# Altium schematic sheet Sheet_1.schdoc
size 257 x 178 mm
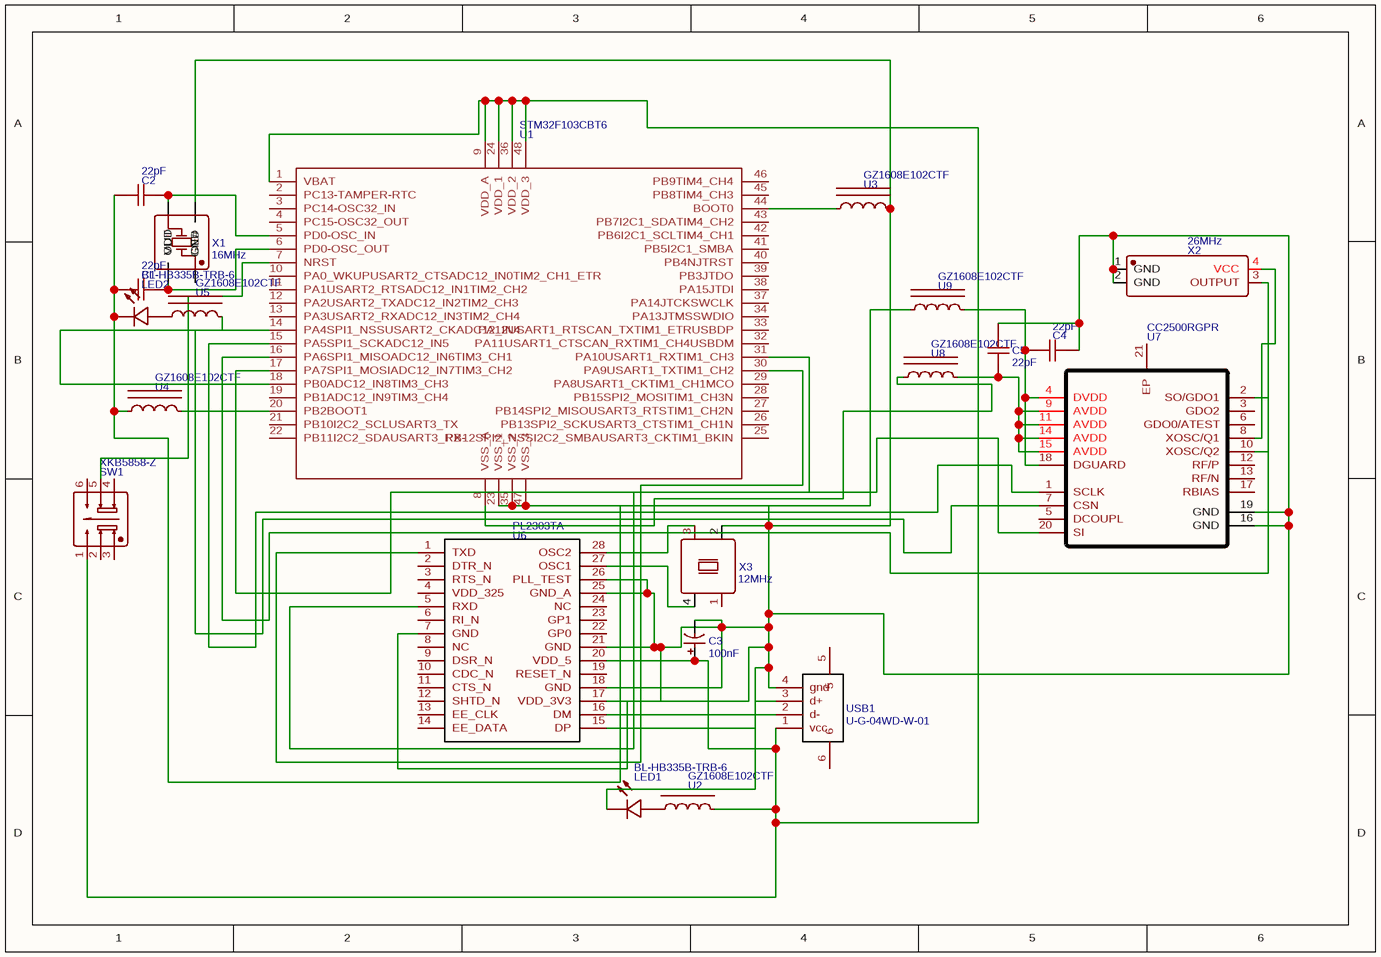
[diagram p0: Sheet_1.schdoc]

## Parts
C1  22pF  [CAP-TH_L4.8-W3.2-P5.08-D0.5]
C2  22pF  [CAP-TH_L4.8-W3.2-P5.08-D0.5]
C3  100nF  [CAP-TH_BD4.0-P1.50-D0.8-FD]
C4  22pF  [CAP-TH_L4.8-W3.2-P5.08-D0.5]
C5  22pF  [CAP-TH_L4.8-W3.2-P5.08-D0.5]
LED1  BL-HB335B-TRB-6  [LED0805-RD]
LED2  BL-HB335B-TRB-6  [LED0805-RD]
SW1  XKB5858-Z  [SW-DIP-5.8X5.8X10]
U1  STM32F103CBT6  [LQFP-48_7X7X05P]
U2  GZ1608E102CTF  [L0603]
U3  GZ1608E102CTF  [L0603]
U4  GZ1608E102CTF  [L0603]
U5  GZ1608E102CTF  [L0603]
U6  PL2303TA  [SSOP-28_L10.2-W5.3-P0.65-LS7.8-BL]
U7  CC2500RGPR  [QFN-20_L4.0-W4.0-P0.50-BL-EP]
U8  GZ1608E102CTF  [L0603]
U9  GZ1608E102CTF  [L0603]
USB1  U-G-04WD-W-01  [USB-A-TH_U-G-04WD-W-01]
X1  16MHz  [OSC-SMD_4P-L7.0-W5.0-BL]
X2  26MHz  [OSC-SMD_4P-L2.5-W2.0-BL]
X3  12MHz  [OSC-SMD_4P-L3.2-W2.5-BL]

## Nets
NetC1_1: C1.1 C2.1 C3.2 C4.2 C5.2 LED1.1(C) LED2.1(C) U1.23(VSS_1) U1.35(VSS_2) U1.47(VSS_3) U3.2 U4.1 U6.7(GND) U6.15(DP) U6.17(VDD_3V3) U6.18(GND) U6.21(GND) U6.25(GND_A) U6.26(PLL_TEST) U7.16(GND) U7.19(GND) U9.1 USB1.3(d+) USB1.4(gnd) X1.2(GND) X2.1(GND) X2.2(GND) X3.2(GND)
NetC1_2: C1.2 U1.6(PD0-OSC_OUT) X1.4(VDD)
NetC2_2: C2.2 U1.5(PD0-OSC_IN) X1.3(OUT)
NetC3_1: C3.1 SW1.1 U1.1(VBAT) U1.9(VDD_A) U1.24(VDD_1) U1.36(VDD_2) U1.48(VDD_3) U2.2 U6.20(VDD_5) USB1.1(vcc)
NetC4_1: C4.1 U7.4(DVDD) U7.18(DGUARD) U9.2
NetC5_1: C5.1 U7.9(AVDD) U7.11(AVDD) U7.14(AVDD) U7.15(AVDD) U8.2
NetLED1_2: LED1.2(A) U2.1
NetLED2_2: LED2.2(A) U5.1
NetSW1_5: SW1.5 U1.7(NRST)
NetU1_8: U1.8(VSS_A) U8.1
NetU1_14: U1.14(PA4SPI1_NSSUSART2_CKADC12_IN4) U1.18(PB0ADC12_IN8TIM3_CH3) U5.2 U7.7(CSN)
NetU1_15: U1.15(PA5SPI1_SCKADC12_IN5) U7.1(SCLK)
NetU1_16: U1.16(PA6SPI1_MISOADC12_IN6TIM3_CH1) U7.2(SO/GDO1) U7.10(XOSC/Q2) X2.3(OUTPUT)
NetU1_17: U1.17(PA7SPI1_MOSIADC12_IN7TIM3_CH2) U1.31(PA10USART1_RXTIM1_CH3) U6.5(RXD) U7.20(SI)
NetU1_20: U1.20(PB2BOOT1) U4.2
NetU1_30: U1.30(PA9USART1_TXTIM1_CH2) U6.1(TXD)
NetU1_44: U1.44(BOOT0) U3.1
NetU6_16: U6.16(DM) USB1.2(d-)
NetU6_27: U6.27(OSC1) X3.4(VCC)
NetU6_28: U6.28(OSC2) X3.3(OUT)
NetU7_8: U7.8(XOSC/Q1) X2.4(VCC)

Not connected (* = marked no-connect by the designer): SW1 2 3 4 6; U1 2(PC13-TAMPER-RTC) 3(PC14-OSC32_IN) 4(PC15-OSC32_OUT) 10(PA0_WKUPUSART2_CTSADC12_IN0TIM2_CH1_ETR) 11(PA1USART2_RTSADC12_IN1TIM2_CH2) 12(PA2USART2_TXADC12_IN2TIM2_CH3) 13(PA3USART2_RXADC12_IN3TIM2_CH4) 19(PB1ADC12_IN9TIM3_CH4) 21(PB10I2C2_SCLUSART3_TX) 22(PB11I2C2_SDAUSART3_RX-) 25(PB12SPI2_NSSI2C2_SMBAUSART3_CKTIM1_BKIN) 26(PB13SPI2_SCKUSART3_CTSTIM1_CH1N) 27(PB14SPI2_MISOUSART3_RTSTIM1_CH2N) 28(PB15SPI2_MOSITIM1_CH3N) 29(PA8USART1_CKTIM1_CH1MCO) 32(PA11USART1_CTSCAN_RXTIM1_CH4USBDM) 33(PA12USART1_RTSCAN_TXTIM1_ETRUSBDP) 34(PA13JTMSSWDIO) 37(PA14JTCKSWCLK) 38(PA15JTDI) 39(PB3JTDO) 40(PB4NJTRST) 41(PB5I2C1_SMBA) 42(PB6I2C1_SCLTIM4_CH1) 43(PB7I2C1_SDATIM4_CH2) 45(PB8TIM4_CH3) 46(PB9TIM4_CH4); U6 2(DTR_N) 3(RTS_N) 4(VDD_325) 6(RI_N) 8(NC) 9(DSR_N) 10(CDC_N) 11(CTS_N) 12(SHTD_N) 13(EE_CLK) 14(EE_DATA) 19(RESET_N) 22(GP0) 23(GP1) 24(NC); U7 3(GDO2) 5(DCOUPL) 6(GDO0/ATEST) 12(RF/P) 13(RF/N) 17(RBIAS) 21(EP); USB1 5 6; X1 1(OE#); X3 1(tri)

## Library data of the parts
C1 C2 C4 C5 = 22pF: BOM_Manufacturer: TORCH; nameAlias: Capacitance; Contributor: LCSC; BOM_Supplier: LCSC; BOM_Supplier Part: C123150; BOM_Manufacturer Part: -; spicePre: C; spiceSymbolName: CC4-0805-CG -50V-22pF-J
C3 = 100nF: BOM_Manufacturer: ValuePro; BOM_Manufacturer Part: 0.1uF 50V 4*7; nameAlias: Capacitance; BOM_Supplier: LCSC; BOM_Supplier Part: C45664; spicePre: C; spiceSymbolName: 0.1uF 50V 4*7
LED1 LED2 = BL-HB335B-TRB-6: BOM_Manufacturer: Bright LED Elec; Contributor: LCSC; BOM_Supplier: LCSC; BOM_Supplier Part: C189307; BOM_Manufacturer Part: BL-HB335B-TRB-6; spicePre: L; spiceSymbolName: BL-HB335B-TRB-6
SW1 = XKB5858-Z: BOM_Manufacturer: XKB Enterprise; Contributor: LCSC; BOM_Supplier: LCSC; BOM_Supplier Part: C318868; BOM_Manufacturer Part: XKB5858-Z; spicePre: S; spiceSymbolName: XKB5858-Z
U1 = STM32F103CBT6: BOM_Manufacturer: STMicroelectronics; SMT Type: Basic; timeStamp: 1458840421; BOM_Supplier: LCSC; BOM_Manufacturer Part: STM32F103CBT6; BOM_LCSC Assembly: Yes; image: //image.lceda.cn/szlcsc/C8304.jpg; BOM_Supplier Part: C8304; spicePre: U; spiceSymbolName: STM32F103CBT6
U2-U5 U8 U9 = GZ1608E102CTF: BOM_Manufacturer: Sunlord; Contributor: LCSC; BOM_Supplier: LCSC; BOM_Supplier Part: C361559; BOM_Manufacturer Part: GZ1608E102CTF; spicePre: U; spiceSymbolName: GZ1608E102CTF
U6 = PL2303TA: BOM_Manufacturer: PROLIFIC; BOM_Supplier: LCSC; BOM_Manufacturer Part: PL2303TA; image: //image.lceda.cn/szlcsc/C8691.jpg; BOM_Supplier Part: C8691; spicePre: U; spiceSymbolName: PL2303TA
U7 = CC2500RGPR: BOM_Manufacturer: TI; SMT Type: Extend; BOM_Supplier: LCSC; BOM_Manufacturer Part: CC2500RGPR; image: //image.lceda.cn/szlcsc/C57494.jpg; BOM_Supplier Part: C57494; BOM_LCSC Assembly: Yes; spicePre: U; spiceSymbolName: CC2500RGPR
USB1 = U-G-04WD-W-01: BOM_Manufacturer: Rectangular Connectors - Contacts; Contributor: LCSC; BOM_Supplier: LCSC; BOM_Supplier Part: C189782; BOM_Manufacturer Part: U-G-04WD-W-01; spicePre: U; spiceSymbolName: U-G-04WD-W-01
X1 = 16MHz: BOM_Manufacturer: SHENZHEN CRYSTAL TECH; BOM_Manufacturer Part: 6N16000G33YC; nameAlias: Frequency; Contributor: LCSC; BOM_Supplier: LCSC; BOM_Supplier Part: C252381; spicePre: X; spiceSymbolName: 6N16000G33YC
X2 = 26MHz: BOM_Manufacturer: TXC Corp; BOM_Manufacturer Part: 7L26002015; nameAlias: Frequency; Contributor: LCSC; BOM_Supplier: LCSC; BOM_Supplier Part: C337579; spicePre: X; spiceSymbolName: 7L26002015
X3 = 12MHz: BOM_Manufacturer: TAITIEN Elec; BOM_Manufacturer Part: OXETGLJANF-12MHZ; nameAlias: Frequency; Contributor: LCSC; SMT Type: Extend; BOM_Supplier: LCSC; BOM_Supplier Part: C295522; BOM_LCSC Assembly: Yes; spicePre: X; spiceSymbolName: OXETGLJANF-12MHZ